# Altium project LM35.PrjPcb
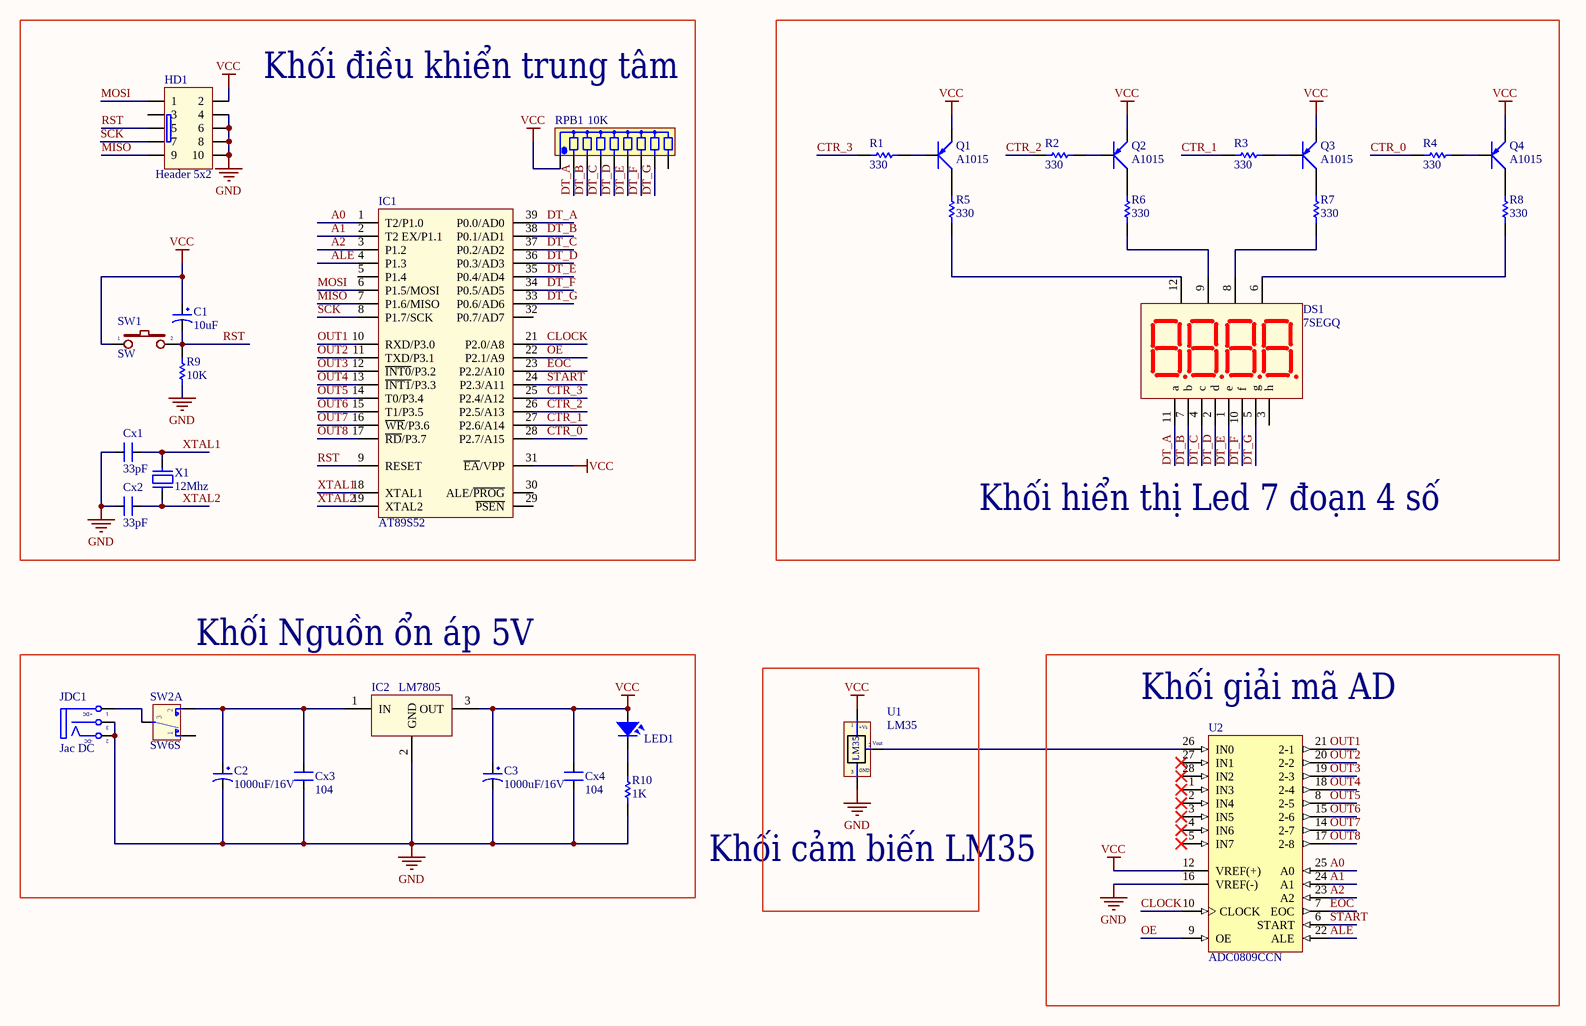
[diagram p0: Sheet1.SchDoc]
1 sheet, 33 parts. Net scope: global (net labels, ports and power ports of the same name join across sheets).
Board file: PCB2.PcbDoc

## Sheet Sheet1.SchDoc
size A3

### Parts
C1  10uF  [CP1/2]
C2  1000uF/16V  [CP1.5/3.4]
C3  1000uF/16V  [CP1.5/3.4]
Cx1  33pF  [CN1]
Cx2  33pF  [CN1]
Cx3  104  [CN1]
Cx4  104  [CN1]
DS1  7SEGQ  [LED7SEG-4-0.36]
HD1  Header 5x2  [Hed2X5]
IC1  AT89S52  [DIP40/W0.6]
IC2  LM7805  [QTO-220]
JDC1  Jac DC  [DC-IN]
LED1  LED  [LED-5-RED]  (value not drawn)
Q1  A1015  [QTO-92]
Q2  A1015  [QTO-92]
Q3  A1015  [QTO-92]
Q4  A1015  [QTO-92]
R1  value 330  [R1/4W]  (hidden comment: Res1)
R2  value 330  [R1/4W]  (hidden comment: Res1)
R3  value 330  [R1/4W]  (hidden comment: Res1)
R4  value 330  [R1/4W]  (hidden comment: Res1)
R5  value 330  [R1/4W]  (hidden comment: Res1)
R6  value 330  [R1/4W]  (hidden comment: Res1)
R7  value 330  [R1/4W]  (hidden comment: Res1)
R8  value 330  [R1/4W]  (hidden comment: Res1)
R9  value 10K  [R1/4W]  (hidden comment: Res1)
R10  value 1K  [R1/4W]  (hidden comment: Res1)
RPB1  10K  [RN8]
SW1  SW  [SW2]
SW2  SW6S  [SW6]  (part A of 2)
U1  LM35  [QTO-92]
U2  ADC0809CCN  [DIP28/W0.6]
X1  12Mhz  [XT2]

### Nets
GND: C2.2 C3.2 Cx1.1 Cx2.1 Cx3.1 Cx4.1 HD1.4 HD1.6 HD1.8 HD1.10 IC1.20(GND) IC2.2(GND) JDC1.2(TN) JDC1.3(S) R9.2 R10.1 U1.3(-) U2.13(GND) U2.16(VREF(-))
VCC: C1.1 C3.1 Cx4.2 HD1.2 IC1.31(~{EA}/VPP) IC1.40(VCC) IC2.3(OUT) LED1.1 Q1.1(E) Q2.1(E) Q3.1(E) Q4.1(E) RPB1.1 SW1.1 U1.1(+Vs) U2.11(VCC) U2.12(VREF(+))
A0: IC1.1(T2/P1.0) U2.25(A0)
A1: IC1.2(T2_EX/P1.1) U2.24(A1)
A2: IC1.3(P1.2) U2.23(A2)
ALE: IC1.4(P1.3) U2.22(ALE)
CLOCK: IC1.21(P2.0/A8) U2.10(CLOCK)
CTR_0: IC1.28(P2.7/A15) R4.2
CTR_1: IC1.27(P2.6/A14) R3.2
CTR_2: IC1.26(P2.5/A13) R2.2
CTR_3: IC1.25(P2.4/A12) R1.2
DT_A: DS1.11(a) IC1.39(P0.0/AD0) RPB1.2
DT_B: DS1.7(b) IC1.38(P0.1/AD1) RPB1.3
DT_C: DS1.4(c) IC1.37(P0.2/AD2) RPB1.4
DT_D: DS1.2(d) IC1.36(P0.3/AD3) RPB1.5
DT_E: DS1.1(e) IC1.35(P0.4/AD4) RPB1.6
DT_F: DS1.10(f) IC1.34(P0.5/AD5) RPB1.7
DT_G: DS1.5(g) IC1.33(P0.6/AD6) RPB1.8
EOC: IC1.23(P2.2/A10) U2.7(EOC)
MISO: HD1.9 IC1.7(P1.6/MISO)
MOSI: HD1.1 IC1.6(P1.5/MOSI)
OE: IC1.22(P2.1/A9) U2.9(OE)
OUT1: IC1.10(RXD/P3.0) U2.21(2-1)
OUT2: IC1.11(TXD/P3.1) U2.20(2-2)
OUT3: IC1.12(~{INT0}/P3.2) U2.19(2-3)
OUT4: IC1.13(~{INT1}/P3.3) U2.18(2-4)
OUT5: IC1.14(T0/P3.4) U2.8(2-5)
OUT6: IC1.15(T1/P3.5) U2.15(2-6)
OUT7: IC1.16(~{WR}/P3.6) U2.14(2-7)
OUT8: IC1.17(~{RD}/P3.7) U2.17(2-8)
RST: C1.2 HD1.5 IC1.9(RESET) R9.1 SW1.2
SCK: HD1.7 IC1.8(P1.7/SCK)
START: IC1.24(P2.3/A11) U2.6(START)
XTAL1: Cx1.2 IC1.18(XTAL1) X1.2
XTAL2: Cx2.2 IC1.19(XTAL2) X1.1
NetC2_1: C2.1 Cx3.2 IC2.1(IN) SW2.2
NetDS1_6: DS1.6(V4) R8.1
NetDS1_8: DS1.8(V3) R7.1
NetDS1_9: DS1.9(V2) R6.1
NetDS1_12: DS1.12(V1) R5.1
NetJDC1_1: JDC1.1(T) SW2.3
NetLED1_2: LED1.2 R10.2
NetQ1_2: Q1.2(C) R5.2
NetQ1_3: Q1.3(B) R1.1
NetQ2_2: Q2.2(C) R6.2
NetQ2_3: Q2.3(B) R2.1
NetQ3_2: Q3.2(C) R7.2
NetQ3_3: Q3.3(B) R3.1
NetQ4_2: Q4.2(C) R8.2
NetQ4_3: Q4.3(B) R4.1
NetU1_2: U1.2(Vout) U2.26(IN0)

Not connected (* = marked no-connect by the designer): DS1 3(h); HD1 3; IC1 5(P1.4) 29(~{PSEN}) 30(ALE/~{PROG}) 32(P0.7/AD7); RPB1 9; SW2 1; U2 1(IN3)* 2(IN4)* 3(IN5)* 4(IN6)* 5(IN7)* 27(IN1)* 28(IN2)*

### Notes on the sheet
- Khối điều khiển trung tâm
- Khối hiển thị Led 7 đoạn 4 số
- Khối Nguồn ổn áp 5V
- (near U2) Khối giải mã AD
- Khối cảm biến LM35
- (in symbol DCIN) +DC; -DC
- (in symbol LM35) GND

### Library data of the parts
C1 = Cap 0,1uF->22uF: Cap P  0,1uF < 22uF , 16 - 50V; Value: 10uF/50V; Description 1: 10 => 220uF/6,3V/10V - 10uF => 100uF/16V; Description 2: 0,1uF => 33uF/50V - 10uF => 22uF/63V; Description 3: 0,47uF => 10uF/100V
C2 C3 = CP4: Cap 1000uF/16V - 220uF/50V; Description 5: 4,7uF>10uF/250V_3,3uF>10uF/400V - 2,2uF>4,7uF/450V; Description 1: 2200uF-3300uF/6,3V - 1000uF-2200uF/10V; Description 2: 1000uF/16V - 470uF => 1000uF/25V - 100uF/100V; Description 3: 330uF>470uF/35V_220uF>470uF/50V_10uF>22uF/250V; Description 4: 220uF => 330uF/63V - 10uF =>33uF/160 - 200V; Value: 1000uF/16V
Cx1 Cx2 = CN0: Cremic For Xtal 1pF => 100pF; Value: 33pF
Cx3 Cx4 = CN: Value: 33pF
DS1 = LED7SEG-4: Four 7 Seg Dipslay; Value: LED 7Q SEG
HD1 = HED5x2: Value: Header 5x2
IC1 = AT89S52: AT89S52, 8k Byte Flash Memory , 40 Pin; Value: AT89S52
IC2 = LM78xx: On ap +, from + 5 to + 24VDC; Value: LM7805
JDC1 = DCIN: Jac DC input; Value: Jac DC
LED1 = LED: LED Single colour Green and Red; Value: LED 3 ly Single Colour
Q1-Q4 = A1015: PNP 600mW, ECB; Value: A1015
R1-R10 = Res1_4: Resistor; Manufacturer: Generic Components; Class: Passive; Published: 08/06/2000; Publisher: Altium Hobart Technology Centre; SubClass: Resistor
RPB1 = RN8: Resistor 8 (Thanh); Value: Tro thanh 10K
SW1 = SW2: Switch button 2 pin; Value: SW chip 2 pin
SW2 = SW6S: SW-DTDP - 6 Pin; Value: SW6
U1 = LM35: Teminal; Value: LM35
U2 = ADC0809CCN: 8-bit Microprocessor Compatible A/D Converters With 8-Channel Multiplexer; Manufacturer: National Semiconductor; CompType: ADC IC; PackageTopMarking: NSUZXYYTTE#*ADC0809CCN; Published: 27-Nov-2008; DatasheetVersion: Sep-1992; PackageVersion: revB, Aug-1993; PackageReference: NA28E; Publisher: Altium Limited; PackageDescription: Molded Dip, 28 Lead, .600 Centers, Substractor Package; PartNumber: ADC0809CCN; RoHS: O; PinCount: 28; DigiKeyPartNumber: ADC0809CCN-ND; ComponentLink1Description: ADC0809 Datasheet; ComponentLink1URL: http://www.national.com/ds/AD/ADC0809.pdf; ComponentLink2Description: ADC0809 Web Page; ComponentLink2URL: http://www.national.com/pf/AD/ADC0809.html; ComponentLink3Description: NA28E Package Page; ComponentLink3URL: http://www.national.com/packaging/folders/na28e.html
X1 = XT2: Crystal, 32.768 KHz, -40 to 85 degC, 3.2 x 1.5 x 0.9 mm SMD; Value: 4Mhz